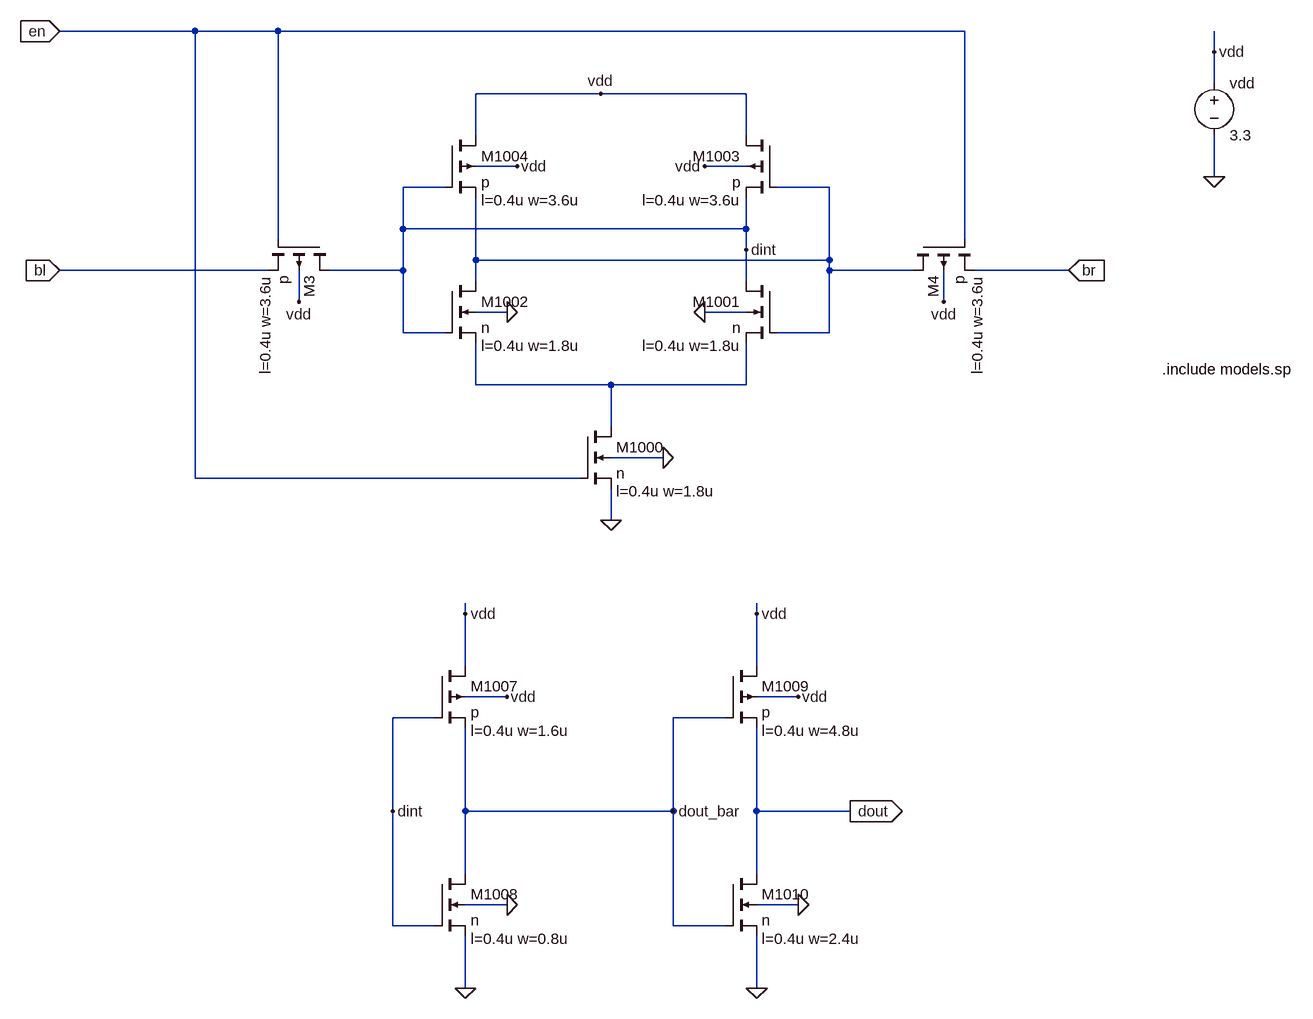
[diagram p0: schematic sense_amp.asc]
sense_amp.asc, the LTspice schematic file:
Version 4
SHEET 1 2104 2356
WIRE -2128 864 -2336 864
WIRE -2000 864 -2128 864
WIRE -944 864 -2000 864
WIRE -560 896 -560 864
WIRE -560 944 -560 896
WIRE -1504 960 -1696 960
WIRE -1280 960 -1504 960
WIRE -1696 1024 -1696 960
WIRE -1280 1024 -1280 960
WIRE -1632 1072 -1696 1072
WIRE -1280 1072 -1344 1072
WIRE -560 1088 -560 1024
WIRE -1744 1104 -1808 1104
WIRE -1152 1104 -1232 1104
WIRE -1808 1168 -1808 1104
WIRE -1280 1168 -1280 1120
WIRE -1280 1168 -1808 1168
WIRE -2000 1184 -2000 864
WIRE -944 1184 -944 864
WIRE -1280 1200 -1280 1168
WIRE -1696 1216 -1696 1120
WIRE -1152 1216 -1152 1104
WIRE -1152 1216 -1696 1216
WIRE -2016 1232 -2336 1232
WIRE -1808 1232 -1808 1168
WIRE -1808 1232 -1920 1232
WIRE -1152 1232 -1152 1216
WIRE -1024 1232 -1152 1232
WIRE -784 1232 -928 1232
WIRE -1696 1248 -1696 1216
WIRE -1280 1248 -1280 1200
WIRE -1968 1280 -1968 1232
WIRE -976 1280 -976 1232
WIRE -1648 1296 -1696 1296
WIRE -1280 1296 -1344 1296
WIRE -1808 1328 -1808 1232
WIRE -1744 1328 -1808 1328
WIRE -1152 1328 -1152 1232
WIRE -1152 1328 -1232 1328
WIRE -1696 1408 -1696 1344
WIRE -1488 1408 -1696 1408
WIRE -1280 1408 -1280 1344
WIRE -1280 1408 -1488 1408
WIRE -1488 1472 -1488 1408
WIRE -1408 1520 -1488 1520
WIRE -2128 1552 -2128 864
WIRE -1536 1552 -2128 1552
WIRE -1488 1616 -1488 1568
WIRE -1712 1760 -1712 1744
WIRE -1264 1760 -1264 1744
WIRE -1712 1840 -1712 1760
WIRE -1264 1840 -1264 1760
WIRE -1648 1888 -1712 1888
WIRE -1200 1888 -1264 1888
WIRE -1760 1920 -1824 1920
WIRE -1312 1920 -1392 1920
WIRE -1824 2064 -1824 1920
WIRE -1712 2064 -1712 1936
WIRE -1392 2064 -1392 1920
WIRE -1392 2064 -1712 2064
WIRE -1264 2064 -1264 1936
WIRE -1120 2064 -1264 2064
WIRE -1712 2160 -1712 2064
WIRE -1264 2160 -1264 2064
WIRE -1648 2208 -1712 2208
WIRE -1200 2208 -1264 2208
WIRE -1824 2240 -1824 2064
WIRE -1760 2240 -1824 2240
WIRE -1392 2240 -1392 2064
WIRE -1312 2240 -1392 2240
WIRE -1712 2336 -1712 2256
WIRE -1264 2336 -1264 2256
FLAG -1712 2336 0
FLAG -560 1088 0
FLAG -560 896 vdd
FLAG -1264 1760 vdd
FLAG -1712 1760 vdd
FLAG -1824 2064 dint
FLAG -1392 2064 dout_bar
FLAG -1264 2336 0
FLAG -1120 2064 dout
IOPIN -1120 2064 Out
FLAG -1488 1616 0
FLAG -1280 1200 dint
FLAG -1504 960 vdd
FLAG -1648 2208 0
FLAG -1200 2208 0
FLAG -1344 1296 0
FLAG -1648 1296 0
FLAG -1408 1520 0
FLAG -1632 1072 vdd
FLAG -1344 1072 vdd
FLAG -1200 1888 vdd
FLAG -1648 1888 vdd
FLAG -2336 864 en
IOPIN -2336 864 In
FLAG -2336 1232 bl
IOPIN -2336 1232 In
FLAG -784 1232 br
IOPIN -784 1232 In
FLAG -976 1280 vdd
FLAG -1968 1280 vdd
SYMBOL nmos4 -1536 1472 R0
WINDOW 123 56 100 Left 2
SYMATTR Value2 l=0.4u w=1.8u
SYMATTR InstName M1000
SYMATTR Value n
SYMBOL nmos4 -1232 1248 M0
WINDOW 123 56 100 Left 2
SYMATTR Value2 l=0.4u w=1.8u
SYMATTR InstName M1001
SYMATTR Value n
SYMBOL nmos4 -1744 1248 R0
WINDOW 123 56 100 Left 2
SYMATTR Value2 l=0.4u w=1.8u
SYMATTR InstName M1002
SYMATTR Value n
SYMBOL nmos4 -1760 2160 R0
WINDOW 123 56 100 Left 2
SYMATTR Value2 l=0.4u w=0.8u
SYMATTR InstName M1008
SYMATTR Value n
SYMBOL nmos4 -1312 2160 R0
WINDOW 123 56 100 Left 2
SYMATTR Value2 l=0.4u w=2.4u
SYMATTR InstName M1010
SYMATTR Value n
SYMBOL pmos4 -1232 1024 M0
WINDOW 123 56 100 Left 2
SYMATTR Value2 l=0.4u w=3.6u
SYMATTR InstName M1003
SYMATTR Value p
SYMBOL pmos4 -1744 1024 R0
WINDOW 123 56 100 Left 2
SYMATTR Value2 l=0.4u w=3.6u
SYMATTR InstName M1004
SYMATTR Value p
SYMBOL pmos4 -1312 1840 R0
WINDOW 123 56 100 Left 2
SYMATTR Value2 l=0.4u w=4.8u
SYMATTR InstName M1009
SYMATTR Value p
SYMBOL pmos4 -1760 1840 R0
WINDOW 123 56 100 Left 2
SYMATTR Value2 l=0.4u w=1.6u
SYMATTR InstName M1007
SYMATTR Value p
SYMBOL voltage -560 928 R0
SYMATTR InstName vdd
SYMATTR Value 3.3
SYMBOL pmos4 -1920 1184 R90
WINDOW 123 56 100 Left 2
SYMATTR Value2 l=0.4u w=3.6u
SYMATTR InstName M3
SYMATTR Value p
SYMBOL pmos4 -1024 1184 M90
WINDOW 123 56 100 Left 2
SYMATTR Value2 l=0.4u w=3.6u
SYMATTR InstName M4
SYMATTR Value p
TEXT -640 1384 Left 2 !.include models.sp

The netlist it stands for:
* sense_amp.asc
M1000 N002 en 0 0 n l=0.4u w=1.8u
M1001 dint N001 N002 0 n l=0.4u w=1.8u
M1002 N001 dint N002 0 n l=0.4u w=1.8u
M1008 dout_bar dint 0 0 n l=0.4u w=0.8u
M1010 dout dout_bar 0 0 n l=0.4u w=2.4u
M1003 vdd N001 dint vdd p l=0.4u w=3.6u
M1004 vdd dint N001 vdd p l=0.4u w=3.6u
M1009 vdd dout_bar dout vdd p l=0.4u w=4.8u
M1007 vdd dint dout_bar vdd p l=0.4u w=1.6u
vdd vdd 0 3.3
M3 dint en bl vdd p l=0.4u w=3.6u
M4 N001 en br vdd p l=0.4u w=3.6u
.model NMOS NMOS
.model PMOS PMOS
.lib standard.mos
.include models.sp
.backanno
.end